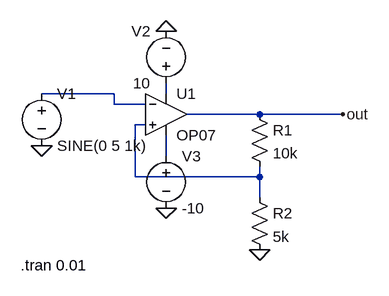
[diagram p0: schematic (9)schmitt_trigger_using_op-amp[1].asc]
(9)schmitt_trigger_using_op-amp[1].asc, the LTspice schematic file:
Version 4
SHEET 1 880 680
WIRE 144 128 32 128
WIRE 224 128 224 112
WIRE 144 144 144 128
WIRE 192 144 144 144
WIRE 368 160 256 160
WIRE 496 160 368 160
WIRE 192 176 176 176
WIRE 224 224 224 192
WIRE 176 256 176 176
WIRE 368 256 368 240
WIRE 368 256 176 256
WIRE 368 288 368 256
FLAG 368 368 0
FLAG 32 208 0
FLAG 224 32 0
FLAG 224 304 0
FLAG 496 160 out
SYMBOL OpAmps\\OP07 224 96 R0
SYMATTR InstName U1
SYMBOL res 352 144 R0
SYMATTR InstName R1
SYMATTR Value 10k
SYMBOL res 352 272 R0
SYMATTR InstName R2
SYMATTR Value 5k
SYMBOL voltage 32 112 R0
WINDOW 123 0 0 Left 0
WINDOW 39 0 0 Left 0
SYMATTR InstName V1
SYMATTR Value SINE(0 5 1k)
SYMBOL voltage 224 128 R180
WINDOW 0 24 96 Left 2
WINDOW 3 24 16 Left 2
WINDOW 123 0 0 Left 0
WINDOW 39 0 0 Left 0
SYMATTR InstName V2
SYMATTR Value 10
SYMBOL voltage 224 208 R0
WINDOW 123 0 0 Left 0
WINDOW 39 0 0 Left 0
SYMATTR InstName V3
SYMATTR Value -10
TEXT 0 392 Left 2 !.tran 0.01

The netlist it stands for:
* (9)schmitt_trigger_using_op-amp[1].asc
XU1 N003 N001 N002 N004 out LT1001  ; OP07, pins In+ In- V+ V- OUT
R1 out N003 10k
R2 N003 0 5k
V1 N001 0 SINE(0 5 1k)
V2 N002 0 10
V3 N004 0 -10
.tran 0.01
.lib LTC.lib
.backanno
.end